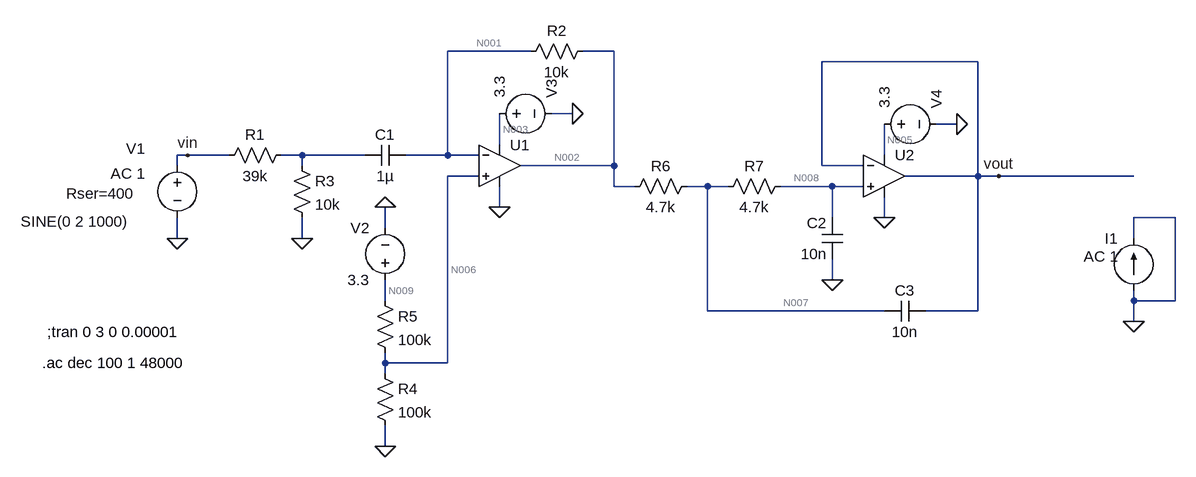
[diagram p0: schematic antialising_input_sallenkey.asc]
antialising_input_sallenkey.asc, the LTspice schematic file:
Version 4
SHEET 1 1128 852
WIRE -720 -352 -848 -352
WIRE -592 -352 -640 -352
WIRE -32 -336 -272 -336
WIRE -656 -256 -688 -256
WIRE -64 -240 -96 -240
WIRE -768 -208 -768 -256
WIRE -1248 -192 -1264 -192
WIRE -1184 -192 -1248 -192
WIRE -1072 -192 -1104 -192
WIRE -976 -192 -1072 -192
WIRE -848 -192 -848 -352
WIRE -848 -192 -912 -192
WIRE -800 -192 -848 -192
WIRE -176 -192 -176 -240
WIRE -1264 -176 -1264 -192
WIRE -1072 -176 -1072 -192
WIRE -592 -176 -592 -352
WIRE -592 -176 -736 -176
WIRE -272 -176 -272 -336
WIRE -208 -176 -272 -176
WIRE -800 -160 -848 -160
WIRE -32 -160 -32 -336
WIRE -32 -160 -144 -160
WIRE 0 -160 -32 -160
WIRE 208 -160 0 -160
WIRE -592 -144 -592 -176
WIRE -560 -144 -592 -144
WIRE -448 -144 -480 -144
WIRE -416 -144 -448 -144
WIRE -256 -144 -336 -144
WIRE -208 -144 -256 -144
WIRE -768 -112 -768 -144
WIRE -256 -96 -256 -144
WIRE -176 -96 -176 -128
WIRE 272 -96 208 -96
WIRE -944 -80 -944 -112
WIRE -1264 -64 -1264 -96
WIRE -1072 -64 -1072 -96
WIRE 208 -64 208 -96
WIRE -256 0 -256 -32
WIRE -944 32 -944 0
WIRE 208 32 208 16
WIRE 272 32 272 -96
WIRE 272 32 208 32
WIRE -448 48 -448 -144
WIRE -176 48 -448 48
WIRE -32 48 -32 -160
WIRE -32 48 -112 48
WIRE 208 64 208 32
WIRE -944 128 -944 112
WIRE -848 128 -848 -160
WIRE -848 128 -944 128
WIRE -944 144 -944 128
WIRE -944 256 -944 224
FLAG -944 256 0
FLAG -944 -112 0
FLAG -1264 -64 0
FLAG -1248 -192 vin
FLAG -656 -256 0
FLAG -768 -112 0
FLAG -1072 -64 0
FLAG -64 -240 0
FLAG -176 -96 0
FLAG 0 -160 vout
FLAG -256 0 0
FLAG 208 64 0
SYMBOL res -960 128 R0
SYMATTR InstName R4
SYMATTR Value 100k
SYMBOL res -960 16 R0
SYMATTR InstName R5
SYMATTR Value 100k
SYMBOL voltage -944 16 R180
WINDOW 0 24 96 Left 2
WINDOW 3 24 16 Left 2
WINDOW 123 0 0 Left 0
WINDOW 39 0 0 Left 0
SYMATTR InstName V2
SYMATTR Value 3.3
SYMBOL voltage -1264 -192 R0
WINDOW 3 -241 102 Left 2
WINDOW 123 -103 28 Left 2
WINDOW 39 -171 59 Left 2
WINDOW 0 -79 -10 Left 2
SYMATTR Value SINE(0 2 1000)
SYMATTR Value2 AC 1
SYMATTR SpiceLine Rser=400
SYMATTR InstName V1
SYMBOL Opamps\\UniversalOpamp2 -768 -176 R0
SYMATTR InstName U1
SYMBOL voltage -784 -256 R270
WINDOW 0 24 96 Left 2
WINDOW 3 24 16 Left 2
WINDOW 123 0 0 Left 0
WINDOW 39 0 0 Left 0
SYMATTR InstName V3
SYMATTR Value 3.3
SYMBOL res -1088 -208 R90
WINDOW 0 0 56 VBottom 2
WINDOW 3 32 56 VTop 2
SYMATTR InstName R1
SYMATTR Value 39k
SYMBOL cap -912 -208 R90
WINDOW 0 0 32 VBottom 2
WINDOW 3 32 32 VTop 2
SYMATTR InstName C1
SYMATTR Value 1µ
SYMBOL res -624 -368 R90
WINDOW 0 0 56 VBottom 2
WINDOW 3 32 56 VTop 2
SYMATTR InstName R2
SYMATTR Value 10k
SYMBOL res -1088 -192 R0
SYMATTR InstName R3
SYMATTR Value 10k
SYMBOL Opamps\\UniversalOpamp2 -176 -160 R0
SYMATTR InstName U2
SYMBOL voltage -192 -240 R270
WINDOW 0 24 96 Left 2
WINDOW 3 24 16 Left 2
WINDOW 123 0 0 Left 0
WINDOW 39 0 0 Left 0
SYMATTR InstName V4
SYMATTR Value 3.3
SYMBOL res -464 -160 R90
WINDOW 0 0 56 VBottom 2
WINDOW 3 32 56 VTop 2
SYMATTR InstName R6
SYMATTR Value 4.7k
SYMBOL res -320 -160 R90
WINDOW 0 0 56 VBottom 2
WINDOW 3 32 56 VTop 2
SYMATTR InstName R7
SYMATTR Value 4.7k
SYMBOL cap -240 -32 R180
WINDOW 0 24 56 Left 2
WINDOW 3 24 8 Left 2
SYMATTR InstName C2
SYMATTR Value 10n
SYMBOL cap -176 64 R270
WINDOW 0 32 32 VTop 2
WINDOW 3 0 32 VBottom 2
SYMATTR InstName C3
SYMATTR Value 10n
SYMBOL current 208 16 R180
WINDOW 0 24 80 Left 2
WINDOW 3 24 0 Left 2
WINDOW 123 24 52 Left 2
WINDOW 39 0 0 Left 0
SYMATTR InstName I1
SYMATTR Value ""
SYMATTR Value2 AC 1
TEXT -1472 128 Left 2 !.ac dec 100 1 48000
TEXT -1464 80 Left 2 !;tran 0 3 0 0.00001

The netlist it stands for:
* antialising_input_sallenkey.asc
R4 N006 0 100k
R5 N009 N006 100k
V2 N009 0 3.3
V1 vin 0 SINE(0 2 1000) AC 1 Rser=400
XU1 N006 N001 N003 0 N002 level.2 Avol=1Meg GBW=10Meg Slew=10Meg ilimit=25m rail=0 Vos=0 phimargin=45 en=0 enk=0 in=0 ink=0 Rin=500Meg  ; pins IN+ IN- V+ V- OUT
V3 N003 0 3.3
R1 N004 vin 39k
C1 N001 N004 1µ
R2 N002 N001 10k
R3 N004 0 10k
XU2 N008 vout N005 0 vout level.2 Avol=1Meg GBW=10Meg Slew=10Meg ilimit=25m rail=0 Vos=0 phimargin=45 en=0 enk=0 in=0 ink=0 Rin=500Meg  ; pins IN+ IN- V+ V- OUT
V4 N005 0 3.3
R6 N007 N002 4.7k
R7 N008 N007 4.7k
C2 0 N008 10n
C3 N007 vout 10n
I1 0 0 AC 1
.ac dec 100 1 48000
;tran 0 3 0 0.00001
.lib UniversalOpamps2.sub
.backanno
.end

* Results of the author's LTspice run, read from the files saved beside the schematic
* Operating Point, zero values left out:
*   V(n006) = 1.65 V
*   V(n009) = 3.3 V
*   V(n002) = 1.65 V
*   V(n003) = 3.3 V
*   V(n001) = 1.65 V
*   V(vout) = 1.65 V
*   V(n005) = 3.3 V
*   V(n008) = 1.65 V
*   V(n007) = 1.65 V
*   I(R5) = 16.5 µA
*   I(R4) = 16.5 µA
*   I(V4) = -165 µA
*   I(V3) = -165 µA
*   I(V2) = -16.5 µA
*   Ix(u1:3) = 165 µA
*   Ix(u1:4) = -165 µA
*   Ix(u1:5) = 37.63 pA
*   Ix(u2:3) = 165 µA
*   Ix(u2:4) = -165 µA
*   Ix(u2:5) = 37.65 pA
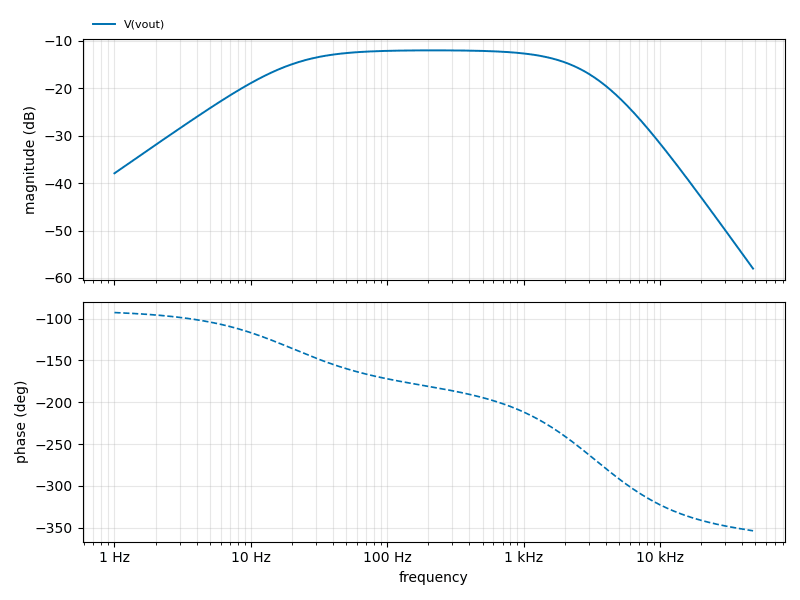
[diagram p1: AC Analysis of antialising_input_sallenkey.asc, plotted from the saved traces]
* AC Analysis, 1 run:
*   V(vout): -37.92 dB at 1 Hz, -58.02 dB at 48 kHz, peak -11.98 dB at 218.8 Hz, 3 dB below the peak at 19.63 Hz and 2.21 kHz